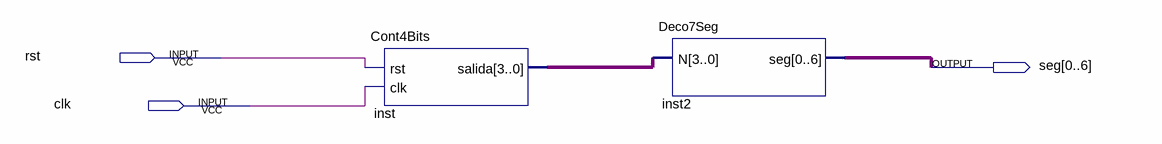
[diagram p0: schematic sheet]
// Quartus schematic Cont4Bits.bdf as structural Verilog: 2 symbols, 3 pins
module Cont4Bits (
  input  rst,
  input  clk,
  output [0:6] seg
);

  wire [3:0] inst_salida;

  Cont4Bits inst (.rst(rst), .clk(clk), .salida(inst_salida));
  Deco7Seg inst2 (.N(inst_salida), .seg(seg));
endmodule
